# Altium schematic sheet JTAG Connector.SchDoc: JTAG Interface
size A4; Organization: Altium Limited; Address1: 3 Minna Close; Address2: Belrose; Address3: NSW 2085; Address4: Australia
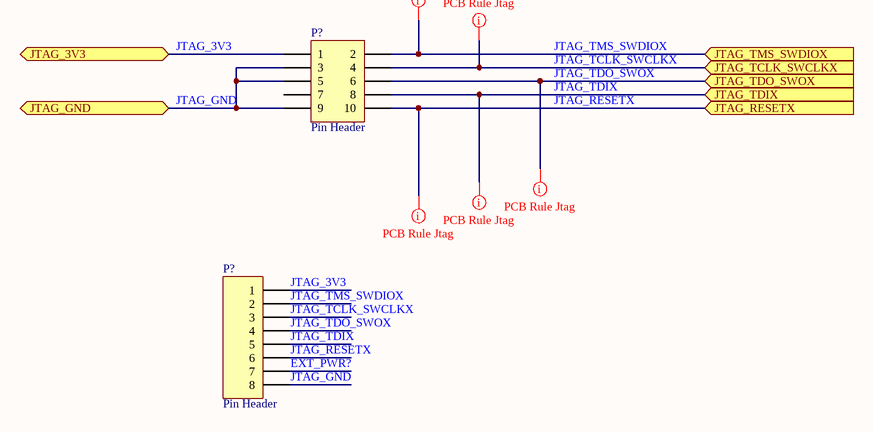
[diagram p0: JTAG Connector.SchDoc]

## Parts
(Parts that share a designator on the sheet are numbered #1, #2 ... from top to bottom, then left to right.)
P?#1  Pin Header  [PH2x5_2.54]
P?#2  Pin Header  [PH1x8_2.54]

## Ports
JTAG_3V3, JTAG_GND, JTAG_RESETX (in), JTAG_TCLK_SWCLKX (in), JTAG_TDIX (in), JTAG_TDO_SWOX (in), JTAG_TMS_SWDIOX (in)

## Nets
EXT_PWR?: P?#2.7
JTAG_3V3: P?#1.1 P?#2.1 ; port JTAG_3V3
JTAG_GND: P?#1.3 P?#1.5 P?#1.9 P?#2.8 ; port JTAG_GND
JTAG_RESETX: P?#1.10 P?#2.6 ; port JTAG_RESETX
JTAG_TCLK_SWCLKX: P?#1.4 P?#2.3 ; port JTAG_TCLK_SWCLKX
JTAG_TDIX: P?#1.8 P?#2.5 ; port JTAG_TDIX
JTAG_TDO_SWOX: P?#1.6 P?#2.4 ; port JTAG_TDO_SWOX
JTAG_TMS_SWDIOX: P?#1.2 P?#2.2 ; port JTAG_TMS_SWDIOX

Not connected (* = marked no-connect by the designer): P?#1 7

## Layout directives
rule Fabrication Testpoint Style [Under Comp - Don't Allow    Sides - Top,    Pref Size = 1.5mm    Pref Hole Size = 0.8128mm    Using Grid = Yes    Grid = 0.0254mm    Grid Tolerance = 0.00025mm]; rule Routing Priority [Priority = 99]: JTAG_RESETX, JTAG_TCLK_SWCLKX, JTAG_TDIX, JTAG_TDO_SWOX, JTAG_TMS_SWDIOX

## Notes on the sheet
- Disclaimer
  Any design and information, hardware or software  is provided on an "as-is" basis without warranty of any kind and any express or implied warranties, including, but not limited to, the implied warranties of merchantability and fitness for a particular purpose are disclaimed. In no event shall wnpd (or KeaDrone)be liable for any direct, indirect, incidental, special, exemplary, or consequential damages (including, but not limited to, procurement of substitute goods or services; loss of use, data, or profits; or business interruption) however caused and on any theory of liability, whether in contract, strict liability, or tort (including negligence or otherwise) arising in any way out of the use of this firmware, hardware, software or information, even if wnpd (or KeaDrone) has been advised by user of the possibility of such potential loss or damage. The user agrees to hold wnpd (or KeaDrone) harmless from and against any and all claims, losses, liabilities and expenses.
- Title
- Size:
- Date:
- A4
- Name:
- Time:
- Ing. W. Pietersz
- Revision:
- Sheet
- of
- WillyPietersz@gmail.com
- Contact:
- -
- www.wnpd.nl
- File:

## Library data of the parts
P?#1 = PH2x5: Header, 5-Pin, Dual row; Part Number: PH2x5; Pitch: 2.54; LatestRevision Note: Initial Release; Type: Pin Header; Number Of Pins: 10; Component Type: Standard; LatestRevision Date: 23-11-2010; Author: Willy Pietersz; Supplier 2: Farnell
P?#2 = PH1x8: Con1x8; Part Number: PH1x8; Pitch: 2.54; LatestRevision Note: Initial Release; Type: Pin Header; Number Of Pins: 8; Component Type: Standard; LatestRevision Date: 23-11-2010; Author: Willy Pietersz; Supplier 2: Farnell